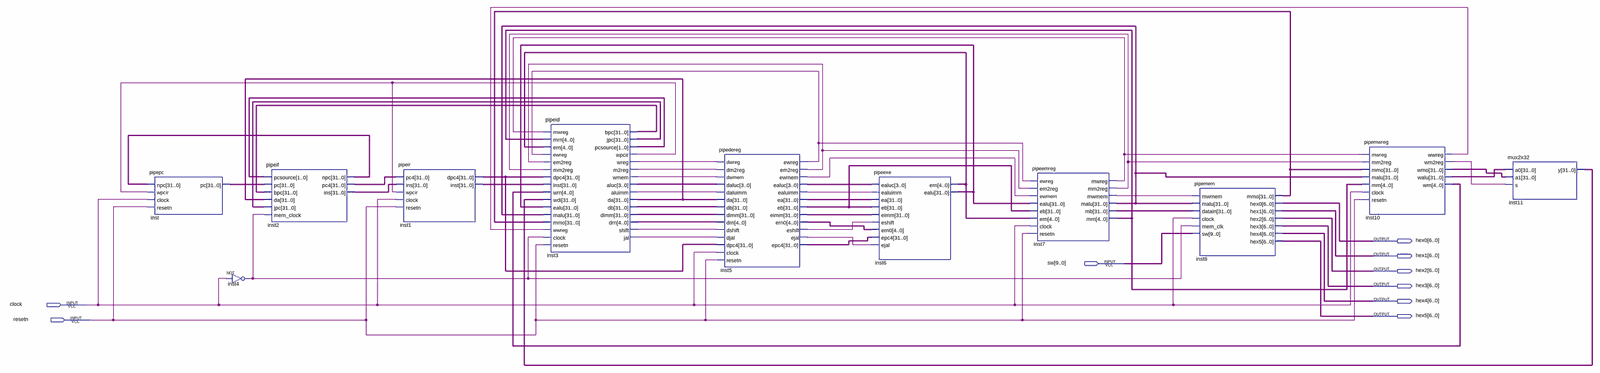
[diagram p0: schematic sheet, whole]
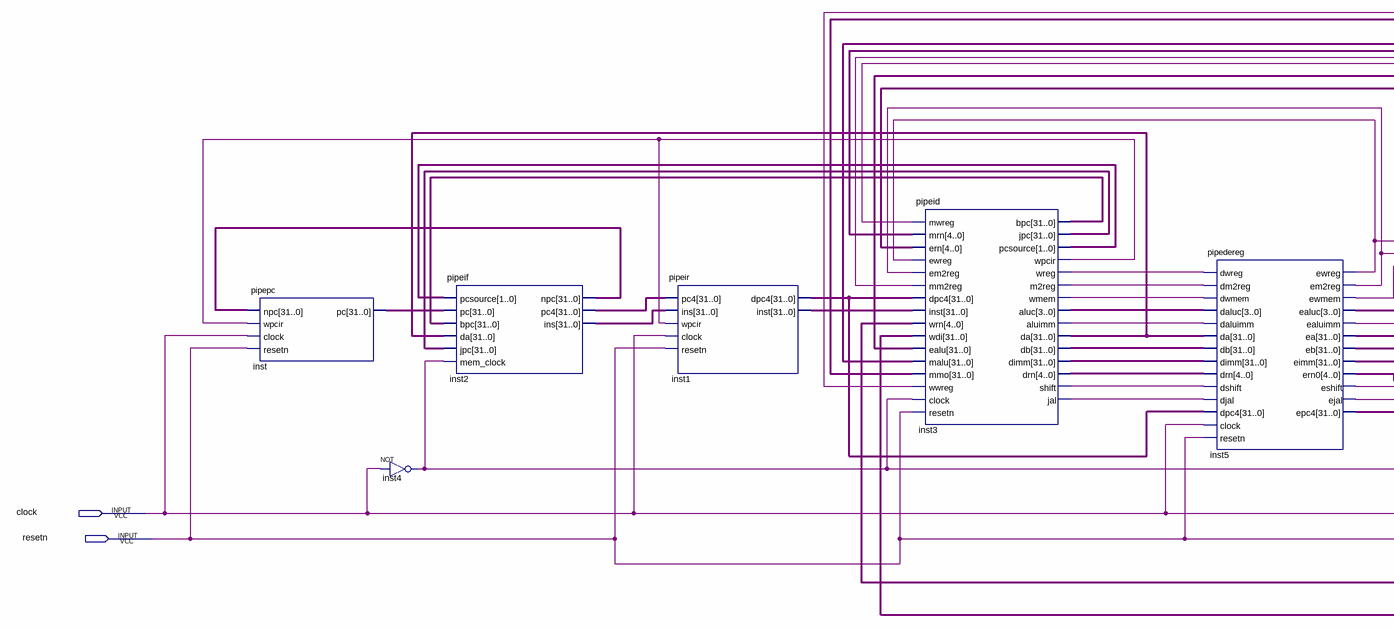
[diagram p1: schematic sheet, left part]
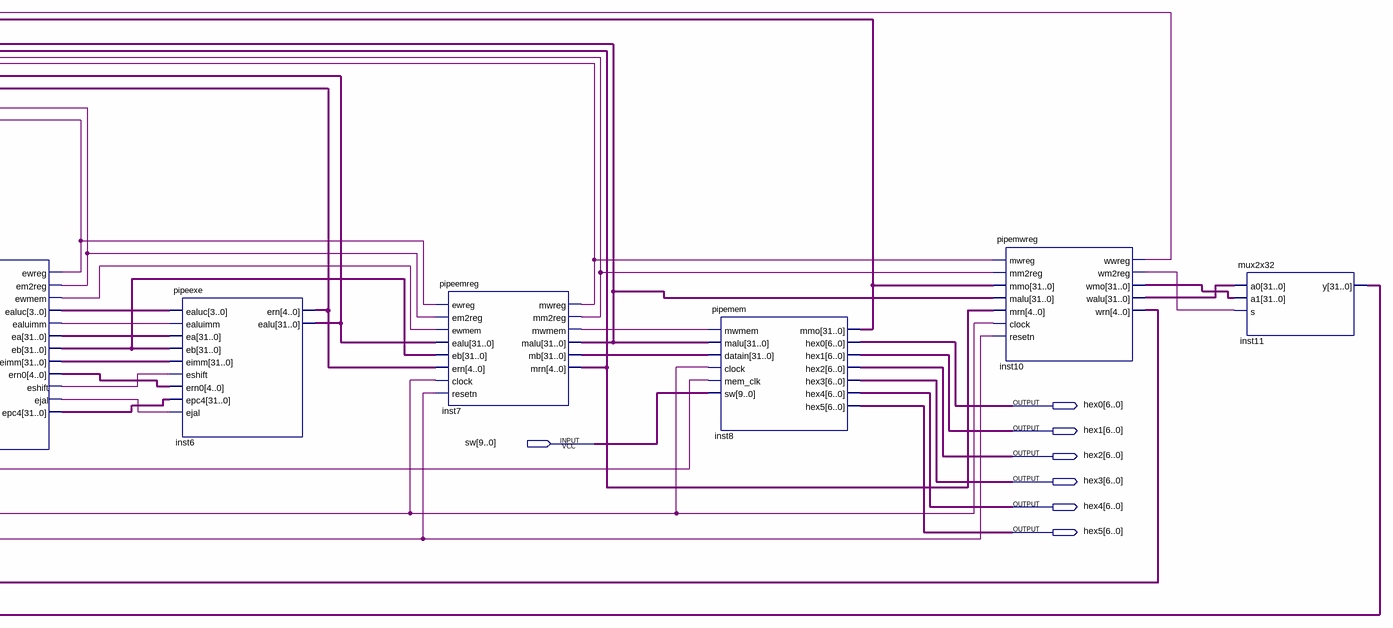
[diagram p2: schematic sheet, right part]
// Quartus schematic pipeline_computer.bdf as structural Verilog: 11 symbols, 9 pins
module pipeline_computer (
  input  [9:0] sw,
  input  clock,
  input  resetn,
  output [6:0] hex0,
  output [6:0] hex1,
  output [6:0] hex2,
  output [6:0] hex3,
  output [6:0] hex4,
  output [6:0] hex5
);

  wire inst3_aluimm, inst3_jal, inst3_m2reg, inst3_shift, inst3_wmem, inst3_wpcir, inst3_wreg, inst4_out,
       inst5_ealuimm, inst5_ejal, inst5_em2reg, inst5_eshift, inst5_ewmem, inst5_ewreg, inst7_mm2reg,
       inst7_mwmem, inst7_mwreg, inst10_wm2reg, inst10_wwreg;
  wire [1:0] inst3_pcsource;
  wire [3:0] inst3_aluc, inst5_ealuc;
  wire [4:0] inst3_drn, inst5_ern0, inst6_ern, inst7_mrn, inst10_wrn;
  wire [31:0] inst1_dpc4, inst1_inst, inst2_ins, inst2_npc, inst2_pc4, inst3_bpc, inst3_da, inst3_db,
       inst3_dimm, inst3_jpc, inst5_ea, inst5_eb, inst5_eimm, inst5_epc4, inst6_ealu, inst7_malu, inst7_mb,
       inst8_mmo, inst10_walu, inst10_wmo, inst11_y, inst_pc;

  pipepc inst (.npc(inst2_npc), .wpcir(inst3_wpcir), .clock(clock), .resetn(resetn), .pc(inst_pc));
  not inst4 (inst4_out, clock);
  pipeif inst2 (
    .pcsource(inst3_pcsource), .pc(inst_pc), .bpc(inst3_bpc), .da(inst3_da), .jpc(inst3_jpc),
    .mem_clock(inst4_out), .npc(inst2_npc), .pc4(inst2_pc4), .ins(inst2_ins));
  pipeir inst1 (
    .pc4(inst2_pc4), .ins(inst2_ins), .wpcir(inst3_wpcir), .clock(clock), .resetn(resetn), .dpc4(inst1_dpc4),
    .inst(inst1_inst));
  pipeid inst3 (
    .mwreg(inst7_mwreg), .mrn(inst7_mrn), .ern(inst6_ern), .ewreg(inst5_ewreg), .em2reg(inst5_em2reg),
    .mm2reg(inst7_mm2reg), .dpc4(inst1_dpc4), .inst(inst1_inst), .wrn(inst10_wrn), .wdi(inst11_y),
    .ealu(inst6_ealu), .malu(inst7_malu), .mmo(inst8_mmo), .wwreg(inst10_wwreg), .clock(inst4_out),
    .resetn(resetn), .bpc(inst3_bpc), .jpc(inst3_jpc), .pcsource(inst3_pcsource), .wpcir(inst3_wpcir),
    .wreg(inst3_wreg), .m2reg(inst3_m2reg), .wmem(inst3_wmem), .aluc(inst3_aluc), .aluimm(inst3_aluimm),
    .da(inst3_da), .db(inst3_db), .dimm(inst3_dimm), .drn(inst3_drn), .shift(inst3_shift), .jal(inst3_jal));
  pipedereg inst5 (
    .dwreg(inst3_wreg), .dm2reg(inst3_m2reg), .dwmem(inst3_wmem), .daluc(inst3_aluc), .daluimm(inst3_aluimm),
    .da(inst3_da), .db(inst3_db), .dimm(inst3_dimm), .drn(inst3_drn), .dshift(inst3_shift), .djal(inst3_jal),
    .dpc4(inst1_dpc4), .clock(clock), .resetn(resetn), .ewreg(inst5_ewreg), .em2reg(inst5_em2reg),
    .ewmem(inst5_ewmem), .ealuc(inst5_ealuc), .ealuimm(inst5_ealuimm), .ea(inst5_ea), .eb(inst5_eb),
    .eimm(inst5_eimm), .ern0(inst5_ern0), .eshift(inst5_eshift), .ejal(inst5_ejal), .epc4(inst5_epc4));
  pipeexe inst6 (
    .ealuc(inst5_ealuc), .ealuimm(inst5_ealuimm), .ea(inst5_ea), .eb(inst5_eb), .eimm(inst5_eimm),
    .eshift(inst5_eshift), .ern0(inst5_ern0), .epc4(inst5_epc4), .ejal(inst5_ejal), .ern(inst6_ern),
    .ealu(inst6_ealu));
  pipeemreg inst7 (
    .ewreg(inst5_ewreg), .em2reg(inst5_em2reg), .ewmem(inst5_ewmem), .ealu(inst6_ealu), .eb(inst5_eb),
    .ern(inst6_ern), .clock(clock), .resetn(resetn), .mwreg(inst7_mwreg), .mm2reg(inst7_mm2reg),
    .mwmem(inst7_mwmem), .malu(inst7_malu), .mb(inst7_mb), .mrn(inst7_mrn));
  pipemem inst8 (
    .mwmem(inst7_mwmem), .malu(inst7_malu), .datain(inst7_mb), .clock(clock), .mem_clk(inst4_out), .sw(sw),
    .mmo(inst8_mmo), .hex0(hex0), .hex1(hex1), .hex2(hex2), .hex3(hex3), .hex4(hex4), .hex5(hex5));
  pipemwreg inst10 (
    .mwreg(inst7_mwreg), .mm2reg(inst7_mm2reg), .mmo(inst8_mmo), .malu(inst7_malu), .mrn(inst7_mrn),
    .clock(clock), .resetn(resetn), .wwreg(inst10_wwreg), .wm2reg(inst10_wm2reg), .wmo(inst10_wmo),
    .walu(inst10_walu), .wrn(inst10_wrn));
  mux2x32 inst11 (.a0(inst10_walu), .a1(inst10_wmo), .s(inst10_wm2reg), .y(inst11_y));
endmodule
